# Altium project AS5047D_Breakout.PrjPCB
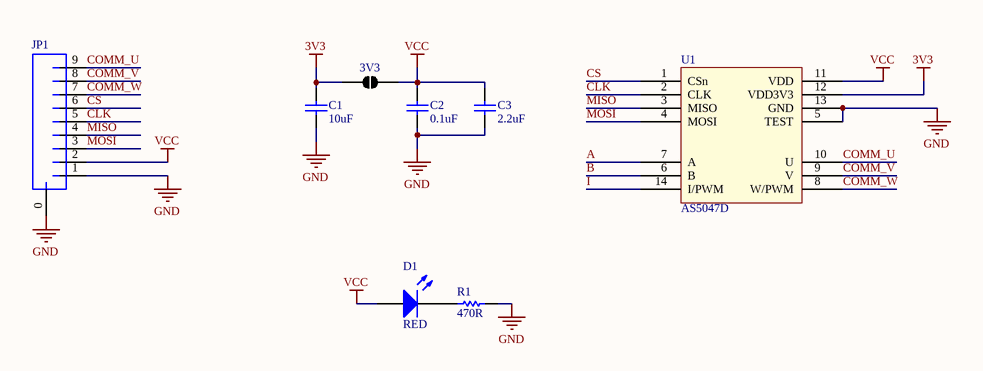
[diagram p0: AS5047D_Breakout.SchDoc]
1 sheet, 8 parts. Net scope: global (net labels, ports and power ports of the same name join across sheets).
Board file: AS5047D_Breakout.PcbDoc

## Sheet AS5047D_Breakout.SchDoc
size A

### Parts
3V3  Solder Jumper  [SOLDER JUMPER]  (value not drawn)
C1  10uF  [CAPC0603(1608)100_L]
C2  0.1uF  [CAPC0603(1608)100_L]
C3  2.2uF  [CAPC0603(1608)100_L]
D1  RED  [0603_A]
JP1  (no value)  [JST-9-SMD-RIGHT-ANGLE]
R1  470R  [RESC0603(1608)_L]
U1  AS5047D  [TSSOP-14]

### Nets
3V3: 3V3.2 C1.1 U1.12(VDD3V3)
GND: C1.2 C2.1 C3.1 JP1.0 JP1.1 R1.1 U1.5(TEST) U1.13(GND)
VCC: 3V3.1 C2.2 C3.2 D1.2(A) JP1.2 U1.11(VDD)
A: U1.7(A)
B: U1.6(B)
CLK: JP1.5 U1.2(CLK)
COMM_U: JP1.9 U1.10(U)
COMM_V: JP1.8 U1.9(V)
COMM_W: JP1.7 U1.8(W/PWM)
CS: JP1.6 U1.1(CSn)
I: U1.14(I/PWM)
MISO: JP1.4 U1.3(MISO)
MOSI: JP1.3 U1.4(MOSI)
NetD1_1: D1.1(K) R1.2

### Library data of the parts
C1 = CMP-1035-02796-1: CAP 10uF 6.3V ±10% 0603 (1608 Metric) Thickness 1mm SMD; Case-EIA: 0603; Tolerance: Â±10%; Case-Metric: 1608; Value: 10uF; Technology: SMT; Rated Voltage: 6.3 V; Max Thickness: 1 mm
C2 = CMP-1035-02591-1: CAP 100nF 50V ±5% 0603 (1608 Metric) Thickness 1mm SMD; Tolerance: Â±5%; Case-Metric: 1608; Case-EIA: 0603; Rated Voltage: 50 V; Max Thickness: 1 mm; Technology: SMT; Value: 100nF
C3 = CMP-1035-02767-1: CAP 2.2uF 25V ±10% 0603 (1608 Metric) Thickness 1mm SMD; Case-EIA: 0603; Tolerance: Â±10%; Case-Metric: 1608; Technology: SMT; Value: 2.2uF; Max Thickness: 1 mm; Rated Voltage: 25 V
D1 = CMP-1426-00001-1: SMD mono-color Chip LED, WL-SMCW, Red; Manufacturer: Wuerth Elektronik; PartNumber: 150060RS75000; Color: Red; PackageReference: 0603_A; ComponentLink2URL: http://katalog.we-online.com/led/datasheet/150060RS75000.pdf; ComponentLink1URL: http://www.we-online.com; ComponentLink1Description: Manufacturer URL; ComponentLink2Description: Datasheet
JP1 = JST-9-SMD-RIGHT-ANGLE: Manufacturer: JST Sales America Inc.; PackageReference: JST-PH; Mounting Technology: Surface Mount
R1 = CMP-1012-00066-1: 470R 0.1W 5% 0603 (1608 Metric)  SMD; Case-Metric: 1608; Case-EIA: 0603; Value: 470.00 Ohm; Tolerance: 5 %; Technology: SMT; Power: 0.1 W